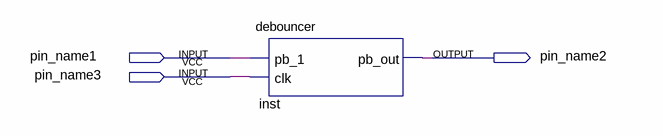
[diagram p0: schematic sheet]
// Quartus schematic debouncer_sim.bdf as structural Verilog: 1 symbols, 3 pins
module debouncer_sim (
  input  pin_name1,
  input  pin_name3,
  output pin_name2
);

  debouncer inst (.pb_1(pin_name1), .clk(pin_name3), .pb_out(pin_name2));
endmodule
